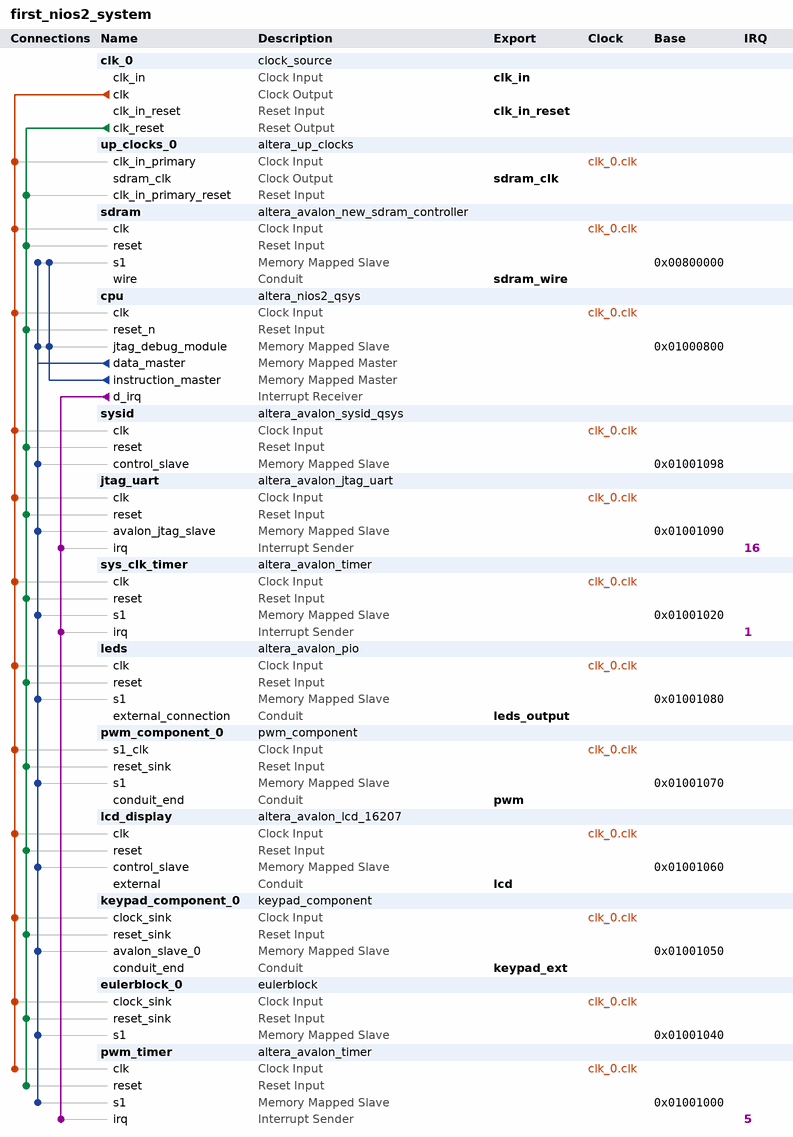
[diagram p0: system contents]
# Platform Designer (Qsys) system first_nios2_system, Cyclone III EP3C16F484C6
# Parameters at their usual value, and those the tool derives, are not listed.
package require -exact qsys 12.1
create_system first_nios2_system
set_project_property DEVICE_FAMILY {Cyclone III}
set_project_property DEVICE EP3C16F484C6

add_instance clk_0 clock_source 12.1
set_instance_parameter_value clk_0 clockFrequency 50000000

add_instance up_clocks_0 altera_up_clocks 12.0
set_instance_parameter_value up_clocks_0 board DE0
set_instance_parameter_value up_clocks_0 vga_clk false
set_instance_parameter_value up_clocks_0 audio_clk true
set_instance_parameter_value up_clocks_0 audio_clk_freq 12.288

add_instance sdram altera_avalon_new_sdram_controller 12.1
set_instance_parameter_value sdram TAC 5.5
set_instance_parameter_value sdram TRCD 20.0
set_instance_parameter_value sdram TRP 20.0
set_instance_parameter_value sdram casLatency 3
set_instance_parameter_value sdram columnWidth 8
set_instance_parameter_value sdram dataWidth 16
set_instance_parameter_value sdram generateSimulationModel false
set_instance_parameter_value sdram model custom
set_instance_parameter_value sdram numberOfBanks 4
set_instance_parameter_value sdram numberOfChipSelects 1
set_instance_parameter_value sdram powerUpDelay 100.0
set_instance_parameter_value sdram refreshPeriod 15.625
set_instance_parameter_value sdram rowWidth 12

add_instance cpu altera_nios2_qsys 12.1
set_instance_parameter_value cpu muldiv_divider true
set_instance_parameter_value cpu resetSlave sdram.s1
set_instance_parameter_value cpu exceptionSlave sdram.s1
set_instance_parameter_value cpu breakSlave cpu.jtag_debug_module
set_instance_parameter_value cpu impl Fast
set_instance_parameter_value cpu icache_size 2048

add_instance sysid altera_avalon_sysid_qsys 12.1
set_instance_parameter_value sysid id -1091637521

add_instance jtag_uart altera_avalon_jtag_uart 12.1
set_instance_parameter_value jtag_uart simInteractiveOptions INTERACTIVE_ASCII_OUTPUT

add_instance sys_clk_timer altera_avalon_timer 12.1
set_instance_parameter_value sys_clk_timer period 1
set_instance_parameter_value sys_clk_timer periodUnits MSEC
set_instance_parameter_value sys_clk_timer timerPreset FULL_FEATURED

add_instance leds altera_avalon_pio 12.1
set_instance_parameter_value leds direction Output
set_instance_parameter_value leds width 10

add_instance pwm_component_0 pwm_component 1.1

add_instance lcd_display altera_avalon_lcd_16207 12.1

add_instance keypad_component_0 keypad_component 1.2

add_instance eulerblock_0 eulerblock 1.1

add_instance pwm_timer altera_avalon_timer 12.1
set_instance_parameter_value pwm_timer alwaysRun true
set_instance_parameter_value pwm_timer fixedPeriod true
set_instance_parameter_value pwm_timer period 100
set_instance_parameter_value pwm_timer periodUnits USEC
set_instance_parameter_value pwm_timer snapshot false
set_instance_parameter_value pwm_timer timerPreset SIMPLE_PERIODIC_INTERRUPT

# connections
add_connection clk_0.clk cpu.clk clock
add_connection clk_0.clk eulerblock_0.clock_sink clock
add_connection clk_0.clk jtag_uart.clk clock
add_connection clk_0.clk keypad_component_0.clock_sink clock
add_connection clk_0.clk lcd_display.clk clock
add_connection clk_0.clk leds.clk clock
add_connection clk_0.clk pwm_component_0.s1_clk clock
add_connection clk_0.clk pwm_timer.clk clock
add_connection clk_0.clk sdram.clk clock
add_connection clk_0.clk sys_clk_timer.clk clock
add_connection clk_0.clk sysid.clk clock
add_connection clk_0.clk up_clocks_0.clk_in_primary clock
add_connection clk_0.clk_reset cpu.reset_n reset
add_connection clk_0.clk_reset eulerblock_0.reset_sink reset
add_connection clk_0.clk_reset jtag_uart.reset reset
add_connection clk_0.clk_reset keypad_component_0.reset_sink reset
add_connection clk_0.clk_reset lcd_display.reset reset
add_connection clk_0.clk_reset leds.reset reset
add_connection clk_0.clk_reset pwm_component_0.reset_sink reset
add_connection clk_0.clk_reset pwm_timer.reset reset
add_connection clk_0.clk_reset sdram.reset reset
add_connection clk_0.clk_reset sys_clk_timer.reset reset
add_connection clk_0.clk_reset sysid.reset reset
add_connection clk_0.clk_reset up_clocks_0.clk_in_primary_reset reset
add_connection cpu.data_master cpu.jtag_debug_module avalon
set_connection_parameter_value cpu.data_master/cpu.jtag_debug_module baseAddress 0x01000800
add_connection cpu.data_master eulerblock_0.s1 avalon
set_connection_parameter_value cpu.data_master/eulerblock_0.s1 baseAddress 0x01001040
add_connection cpu.data_master jtag_uart.avalon_jtag_slave avalon
set_connection_parameter_value cpu.data_master/jtag_uart.avalon_jtag_slave baseAddress 0x01001090
add_connection cpu.data_master keypad_component_0.avalon_slave_0 avalon
set_connection_parameter_value cpu.data_master/keypad_component_0.avalon_slave_0 baseAddress 0x01001050
add_connection cpu.data_master lcd_display.control_slave avalon
set_connection_parameter_value cpu.data_master/lcd_display.control_slave baseAddress 0x01001060
add_connection cpu.data_master leds.s1 avalon
set_connection_parameter_value cpu.data_master/leds.s1 baseAddress 0x01001080
add_connection cpu.data_master pwm_component_0.s1 avalon
set_connection_parameter_value cpu.data_master/pwm_component_0.s1 baseAddress 0x01001070
add_connection cpu.data_master pwm_timer.s1 avalon
set_connection_parameter_value cpu.data_master/pwm_timer.s1 baseAddress 0x01001000
add_connection cpu.data_master sdram.s1 avalon
set_connection_parameter_value cpu.data_master/sdram.s1 baseAddress 0x00800000
add_connection cpu.data_master sys_clk_timer.s1 avalon
set_connection_parameter_value cpu.data_master/sys_clk_timer.s1 baseAddress 0x01001020
add_connection cpu.data_master sysid.control_slave avalon
set_connection_parameter_value cpu.data_master/sysid.control_slave baseAddress 0x01001098
add_connection cpu.instruction_master cpu.jtag_debug_module avalon
set_connection_parameter_value cpu.instruction_master/cpu.jtag_debug_module baseAddress 0x01000800
add_connection cpu.instruction_master sdram.s1 avalon
set_connection_parameter_value cpu.instruction_master/sdram.s1 baseAddress 0x00800000
add_connection cpu.d_irq jtag_uart.irq interrupt
set_connection_parameter_value cpu.d_irq/jtag_uart.irq irqNumber 16
add_connection cpu.d_irq pwm_timer.irq interrupt
set_connection_parameter_value cpu.d_irq/pwm_timer.irq irqNumber 5
add_connection cpu.d_irq sys_clk_timer.irq interrupt
set_connection_parameter_value cpu.d_irq/sys_clk_timer.irq irqNumber 1

# exported interfaces
add_interface clk_in clock sink
set_interface_property clk_in EXPORT_OF clk_0.clk_in
add_interface clk_in_reset reset sink
set_interface_property clk_in_reset EXPORT_OF clk_0.clk_in_reset
add_interface sdram_wire conduit end
set_interface_property sdram_wire EXPORT_OF sdram.wire
add_interface sdram_clk clock source
set_interface_property sdram_clk EXPORT_OF up_clocks_0.sdram_clk
add_interface leds_output conduit end
set_interface_property leds_output EXPORT_OF leds.external_connection
add_interface pwm conduit end
set_interface_property pwm EXPORT_OF pwm_component_0.conduit_end
add_interface lcd conduit end
set_interface_property lcd EXPORT_OF lcd_display.external
add_interface keypad_ext conduit end
set_interface_property keypad_ext EXPORT_OF keypad_component_0.conduit_end

save_system first_nios2_system.qsys
